# Altium schematic sheet Power.SchDoc
size A4
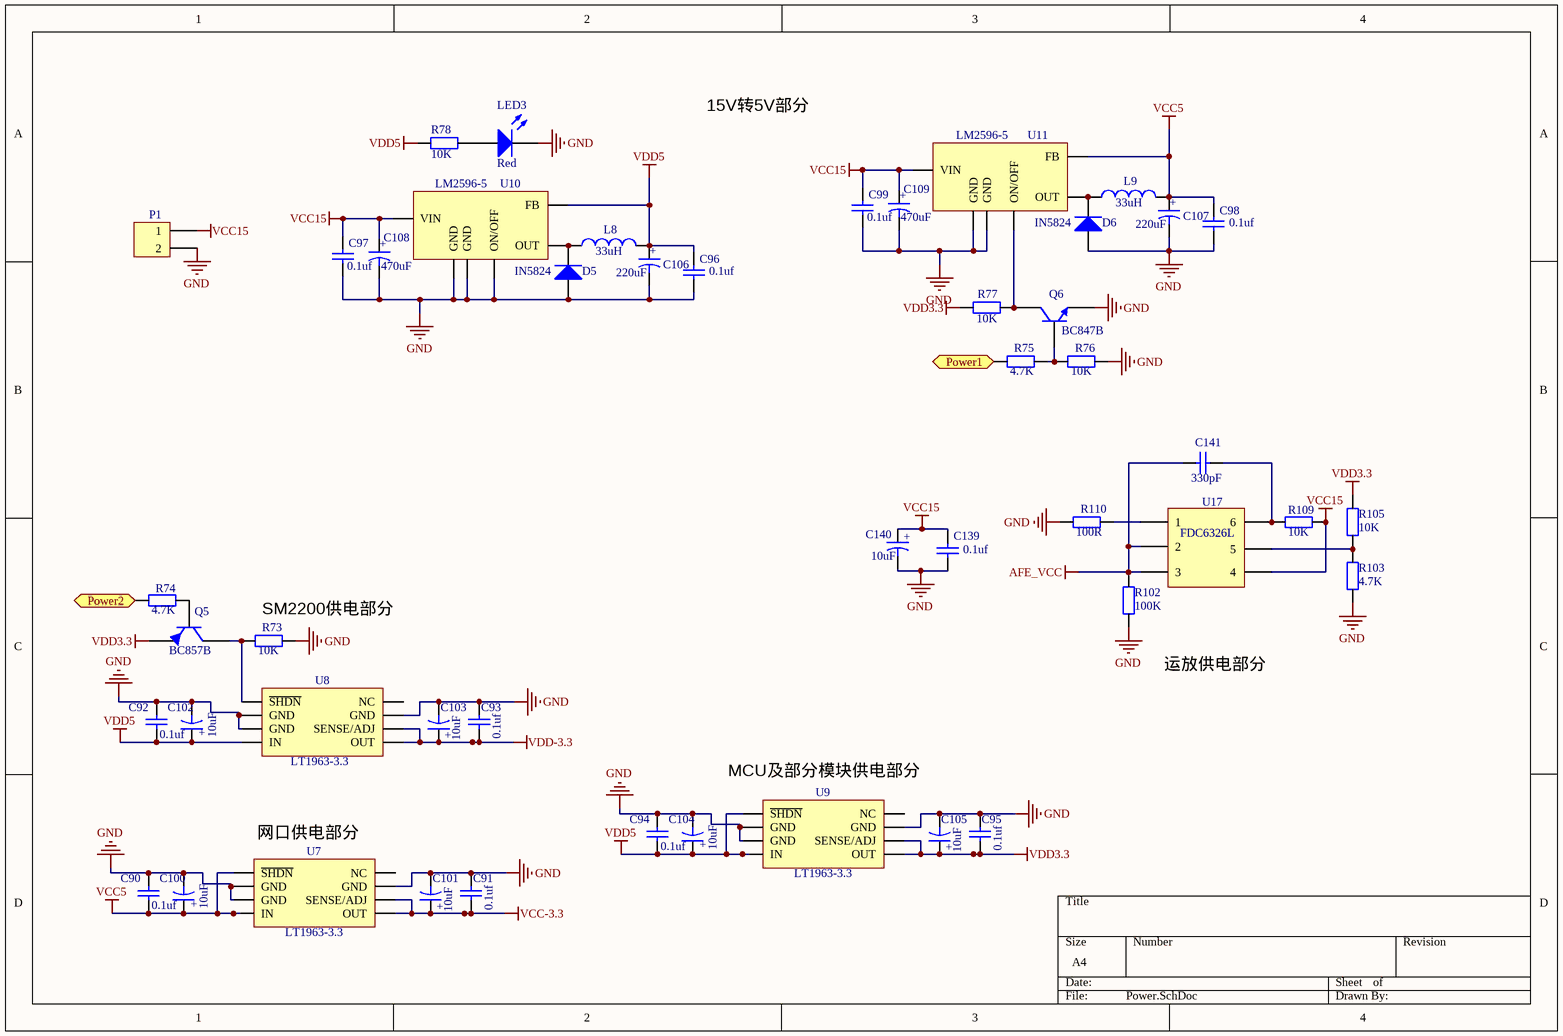
[diagram p0: Power.SchDoc]

## Parts
C90  value 0.1uf  [0805]  (hidden comment: Capacitor-0805)
C91  value 0.1uf  [0805]  (hidden comment: Capacitor-0805)
C92  value 0.1uf  [0805]  (hidden comment: Capacitor-0805)
C93  value 0.1uf  [0805]  (hidden comment: Capacitor-0805)
C94  value 0.1uf  [0805]  (hidden comment: Capacitor-0805)
C95  value 0.1uf  [0805]  (hidden comment: Capacitor-0805)
C96  value 0.1uf  [0805]  (hidden comment: Capacitor-0805)
C97  value 0.1uf  [0805]  (hidden comment: Capacitor-0805)
C98  value 0.1uf  [0805]  (hidden comment: Capacitor-0805)
C99  value 0.1uf  [0805]  (hidden comment: Capacitor-0805)
C100  value 10uF  [钽电容1206（A3216）]  (hidden comment: 电解电容)
C101  value 10uF  [钽电容1206（A3216）]  (hidden comment: 电解电容)
C102  value 10uF  [钽电容1206（A3216）]  (hidden comment: 电解电容)
C103  value 10uF  [钽电容1206（A3216）]  (hidden comment: 电解电容)
C104  value 10uF  [钽电容1206（A3216）]  (hidden comment: 电解电容)
C105  value 10uF  [钽电容1206（A3216）]  (hidden comment: 电解电容)
C106  value 220uF  [贴片铝电容-8*10.3]  (hidden comment: 电解电容)
C107  value 220uF  [贴片铝电容-8*10.3]  (hidden comment: 电解电容)
C108  value 470uF  [贴片铝电容-10*10]  (hidden comment: 电解电容)
C109  value 470uF  [贴片铝电容-10*10]  (hidden comment: 电解电容)
C139  value 0.1uf  [0805]  (hidden comment: Capacitor-0805)
C140  value 10uF  [3528]  (hidden comment: 电解电容)
C141  value 330pF  [0603]  (hidden comment: Capacitor-0805)
D5  IN5824  [IN5824]
D6  IN5824  [IN5824]
L8  value 33uH  [SLF6025   电感]  (hidden comment: Inductor)
L9  value 33uH  [SLF6025   电感]  (hidden comment: Inductor)
LED3  Color: Red  [外插小灯]  (hidden comment: LED)
P1  端子2  [MOLEX-2]  (value not drawn)
Q5  Name: BC857B  [BC847B]  (hidden comment: BC587B)
Q6  BC847  [BC847B]  (value not drawn)
R73  value 10K  [0603]  (hidden comment: Resistor-0603)
R74  value 4.7K  [0603]  (hidden comment: Resistor-0603)
R75  value 4.7K  [0603]  (hidden comment: Resistor-0603)
R76  value 10K  [0603]  (hidden comment: Resistor-0603)
R77  value 10K  [0603]  (hidden comment: Resistor-0603)
R78  value 10K  [0603]  (hidden comment: Resistor-0603)
R102  value 100K  [0603]  (hidden comment: Resistor-0603)
R103  value 4.7K  [0603]  (hidden comment: Resistor-0603)
R105  value 10K  [0603]  (hidden comment: Resistor-0603)
R109  value 10K  [0603]  (hidden comment: Resistor-0603)
R110  value 100R  [0603]  (hidden comment: Resistor-0603)
U7  LT1963  [LT1963]  (value not drawn)
U8  LT1963  [LT1963]  (value not drawn)
U9  LT1963  [LT1963]  (value not drawn)
U10  LM2596  [LM2596]  (value not drawn)
U11  LM2596  [LM2596]  (value not drawn)
U17  FDC6326L  [FDC6326L]

## Ports
Power1 (in), Power2 (in)

## Nets
AFE_VCC: C141.2 R102.2 U17.2 U17.3
GND: C90.2 C91.2 C92.2 C93.2 C94.2 C95.2 C96.1 C97.1 C98.1 C99.1 C100.1 C101.1 C102.1 C103.1 C104.1 C105.1 C106.1 C107.1 C108.1 C109.1 C139.1 C140.1 D5.1(A) D6.1(A) LED3.2 P1.2 Q6.1(E) R73.1 R76.1 R102.1 R103.1 R110.1 U7.3(GND) U7.6(GND) U7.7(GND) U8.3(GND) U8.6(GND) U8.7(GND) U9.3(GND) U9.6(GND) U9.7(GND) U10.3(GND) U10.5(ON/OFF) U10.6(GND) U11.3(GND) U11.6(GND)
VCC5: C90.1 C98.2 C100.2 C107.2 L9.2 U7.5(~{SHDN}) U7.8(IN) U11.4(FB)
VCC15: C97.2 C99.2 C108.2 C109.2 C139.2 C140.2 P1.1 R109.1 U10.1(VIN) U11.1(VIN) U17.4
VCC-3.3: C91.1 C101.2 U7.1(OUT) U7.2(SENSE/ADJ)
VDD3.3: C95.1 C105.2 Q5.1(E) R77.1 R105.2 U9.1(OUT) U9.2(SENSE/ADJ)
VDD5: C92.1 C94.1 C96.2 C102.2 C104.2 C106.2 L8.2 R78.2 U8.8(IN) U9.5(~{SHDN}) U9.8(IN) U10.4(FB)
VDD-3.3: C93.1 C103.2 U8.1(OUT) U8.2(SENSE/ADJ)
Power1: R75.2 ; port Power1
Power2: R74.2 ; port Power2
NetC141_1: C141.1 R109.2 U17.6
NetD5_2: D5.2(K) L8.1 U10.2(OUT)
NetD6_2: D6.2(K) L9.1 U11.2(OUT)
NetLED3_1: LED3.1(A) R78.1
NetQ5_2: Q5.2(B) R74.1
NetQ5_3: Q5.3(C) R73.2 U8.5(~{SHDN})
NetQ6_2: Q6.2(B) R75.1 R76.2
NetQ6_3: Q6.3(C) R77.2 U11.5(ON/OFF)
NetR103_2: R103.2 R105.1 U17.5
NetR110_2: R110.2 U17.1

Not connected (* = marked no-connect by the designer): U7 4(NC); U8 4(NC); U9 4(NC)

## Notes on the sheet
- 15V转5V部分
- (near R73) SM2200供电部分
- 运放供电部分
- (near U9) MCU及部分模块供电部分
- (near U7) 网口供电部分
- (in symbol L) LT1963-3.3; LM2596-5
- (in symbol 电解电容) +

## Library data of the parts
C90-C99 C139 C141 = Capacitor
D5 D6 = I
L8 L9 = Ind
U7-U11 = L
LED3 = LED: Value: LED
Q6 = BC847: Name: BC847B
U17 = FDC6326L: Name: FDC6326L